# Altium schematic sheet MBoard.SchDoc
size A4
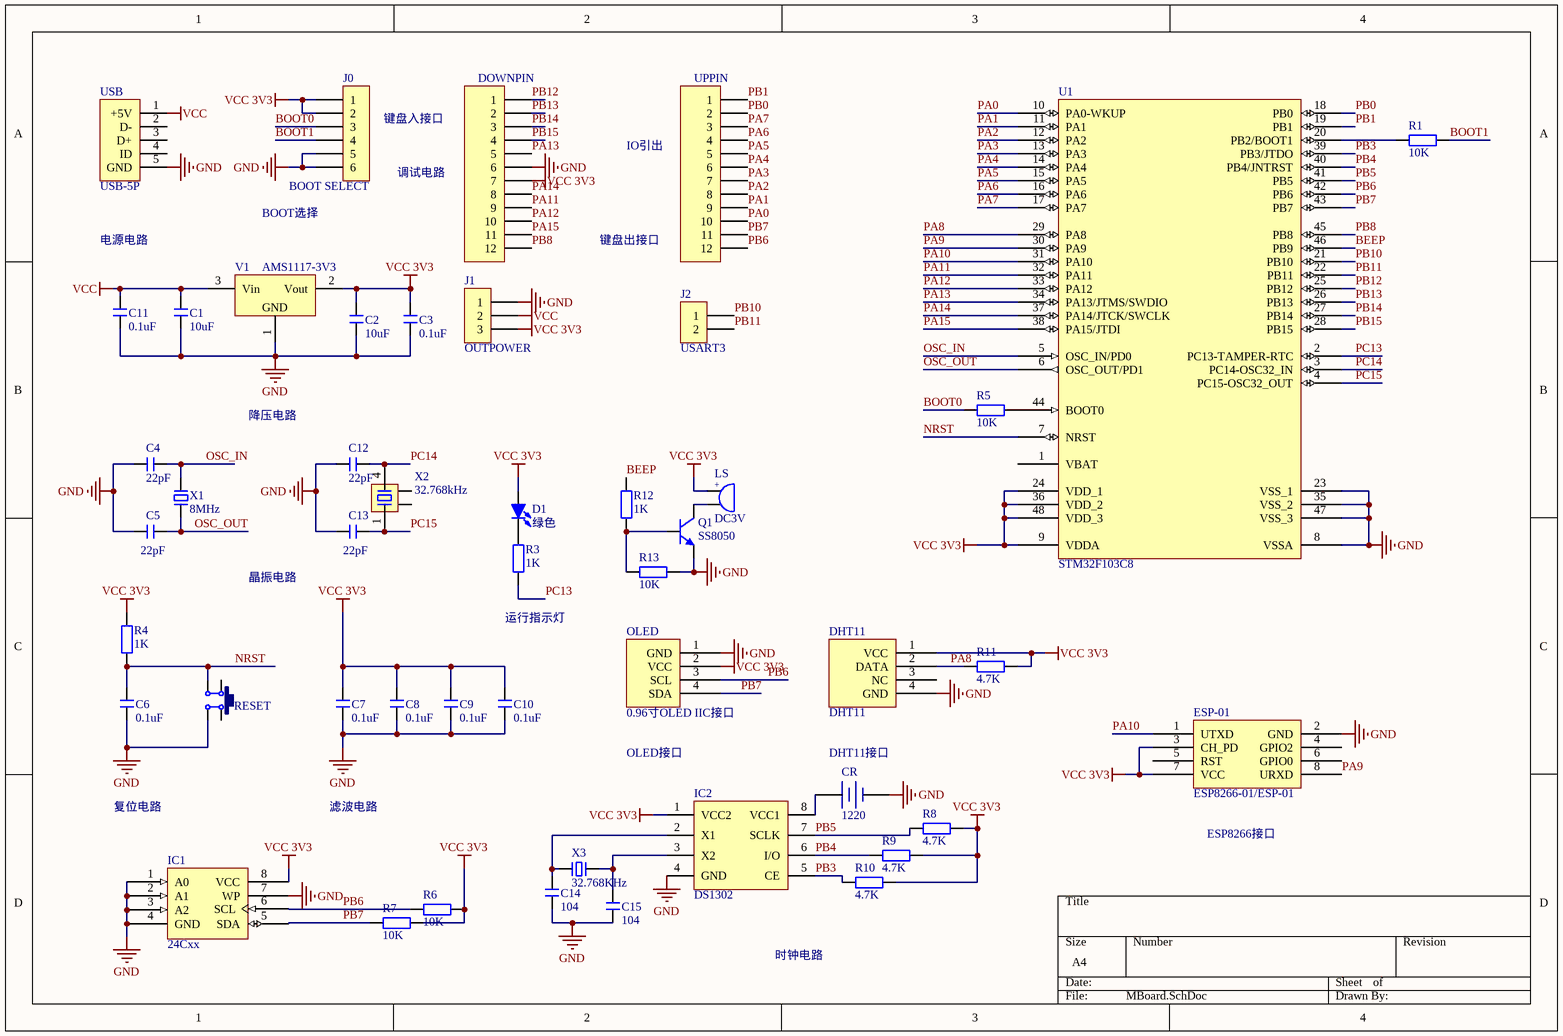
[diagram p0: MBoard.SchDoc]

## Parts
C1  10uF  [C 0805_L]
C2  10uF  [C 0805_L]
C3  0.1uF  [C 0805_L]
C4  22pF  [C 0805_L]
C5  22pF  [C 0805_L]
C6  0.1uF  [C 0805_L]
C7  0.1uF  [C 0805_L]
C8  0.1uF  [C 0805_L]
C9  0.1uF  [C 0805_L]
C10  0.1uF  [C 0805_L]
C11  0.1uF  [C 0805_L]
C12  22pF  [C 0805_L]
C13  22pF  [C 0805_L]
C14  104  [C 0805_L]
C15  104  [C 0805_L]
CR  1220  [CR1220_A]
D1  绿色  [LED 0805R]
DHT11  DHT11  [HDR2.54-LI-4P]
DOWNPIN  CON12  [HDR2.54-LI-12P]  (value not drawn)
ESP-01  ESP8266-01/ESP-01  [ESP-01S NOBRODER]
IC1  24Cxx  [SOP8_M]
IC2  DS1302  [SOP8_M]
J0  BOOT SELECT  [HDR2.54-LI-2x3P]
J1  OUTPOWER  [HDR2.54-LI-3P]
J2  USART3  [HDR2.54-WI-2P]
LS  DC3V  [BEEP 6.5x12x6]
OLED  0.96寸OLED IIC接口  [HDR2.54-M-LI-4P]
Q1  SS8050  [SOT23-3N]
R1  10K  [R 0805_L]
R3  1K  [R 0805_L]
R4  1K  [R 0805_L]
R5  10K  [R 0805_L]
R6  10K  [R 0805_L]
R7  10K  [R 0805_L]
R8  4.7K  [R 0805_L]
R9  4.7K  [R 0805_L]
R10  4.7K  [R 0805_L]
R11  4.7K  [R 0805_L]
R12  1K  [R 0805_L]
R13  10K  [R 0805_L]
RESET  6x6x5  [TSW SMD-6*6*4.3]  (value not drawn)
U1  STM32F103C8  [LQFP48 7X7_M]
UPPIN  CON12  [HDR2.54-LI-12P]  (value not drawn)
USB  USB-5P  [USB-MICRO_A]
V1  AMS1117-3V3  [SOT223_L]
X1  8MHz  [OSC HC-49S]
X2  32.768kHz  [OSC MC-306]
X3  32.768KHz  [OSC-2x6-WI-A]

## Nets
GND: C1.1 C2.1 C3.1 C4.1 C5.1 C6.1 C7.1 C8.1 C9.1 C10.1 C11.1 C12.1 C13.1 C14.1 C15.1 CR.2(DC-) DHT11.4(GND) DOWNPIN.6 ESP-01.2(GND) IC1.1(A0) IC1.2(A1) IC1.3(A2) IC1.4(GND) IC1.7(WP) IC2.4(GND) J0.5 J0.6 J1.1 OLED.1(GND) Q1.2(E) R13.2 RESET.3 U1.8(VSSA) U1.23(VSS_1) U1.35(VSS_2) U1.47(VSS_3) USB.5(GND) V1.1(GND)
VCC: C1.2 C11.2 J1.2 USB.1(+5V) V1.3(Vin)
VCC 3V3: C2.2 C3.2 C7.2 C8.2 C9.2 C10.2 D1.1(A) DHT11.1(VCC) DOWNPIN.7 ESP-01.3(CH_PD) ESP-01.7(VCC) IC1.8(VCC) IC2.1(VCC2) J0.1 J0.2 J1.3 LS.1 OLED.2(VCC) R4.2 R6.2 R7.2 R8.2 R9.2 R10.2 R11.2 U1.9(VDDA) U1.24(VDD_1) U1.36(VDD_2) U1.48(VDD_3) V1.2(Vout)
BEEP: R12.2 U1.46(PB9)
BOOT0: J0.3 R5.1
BOOT1: J0.4 R1.2
NRST: C6.2 R4.1 RESET.4 U1.7(NRST)
OSC_IN: C4.2 U1.5(OSC_IN/PD0) X1.2
OSC_OUT: C5.2 U1.6(OSC_OUT/PD1) X1.1
PA0: U1.10(PA0-WKUP) UPPIN.10
PA1: U1.11(PA1) UPPIN.9
PA2: U1.12(PA2) UPPIN.8
PA3: U1.13(PA3) UPPIN.7
PA4: U1.14(PA4) UPPIN.6
PA5: U1.15(PA5) UPPIN.5
PA6: U1.16(PA6) UPPIN.4
PA7: U1.17(PA7) UPPIN.3
PA8: DHT11.2(DATA) R11.1 U1.29(PA8)
PA9: ESP-01.8(URXD) U1.30(PA9)
PA10: ESP-01.1(UTXD) U1.31(PA10)
PA11: DOWNPIN.9 U1.32(PA11)
PA12: DOWNPIN.10 U1.33(PA12)
PA13: DOWNPIN.5 U1.34(PA13/JTMS/SWDIO)
PA14: DOWNPIN.8 U1.37(PA14/JTCK/SWCLK)
PA15: DOWNPIN.11 U1.38(PA15/JTDI)
PB0: U1.18(PB0) UPPIN.2
PB1: U1.19(PB1) UPPIN.1
PB3: IC2.5(CE) R10.1 U1.39(PB3/JTDO)
PB4: IC2.6(I/O) R9.1 U1.40(PB4/JNTRST)
PB5: IC2.7(SCLK) R8.1 U1.41(PB5)
PB6: IC1.6(SCL) OLED.3(SCL) R6.1 U1.42(PB6) UPPIN.12
PB7: IC1.5(SDA) OLED.4(SDA) R7.1 U1.43(PB7) UPPIN.11
PB8: DOWNPIN.12 U1.45(PB8)
PB10: J2.1 U1.21(PB10)
PB11: J2.2 U1.22(PB11)
PB12: DOWNPIN.1 U1.25(PB12)
PB13: DOWNPIN.2 U1.26(PB13)
PB14: DOWNPIN.3 U1.27(PB14)
PB15: DOWNPIN.4 U1.28(PB15)
PC13: R3.1 U1.2(PC13-TAMPER-RTC)
PC14: C12.2 U1.3(PC14-OSC32_IN) X2.4
PC15: C13.2 U1.4(PC15-OSC32_OUT) X2.1
NetC14_2: C14.2 IC2.2(X1) X3.1
NetC15_2: C15.2 IC2.3(X2) X3.2
NetCR_1: CR.1(DC+) IC2.8(VCC1)
NetD1_2: D1.2(K) R3.2
NetLS_2: LS.2 Q1.3(C)
NetQ1_1: Q1.1(B) R12.1 R13.1
NetR1_1: R1.1 U1.20(PB2/BOOT1)
NetR5_2: R5.2 U1.44(BOOT0)

Not connected (* = marked no-connect by the designer): DHT11 3(NC); ESP-01 4(GPIO2) 5(RST) 6(GPIO0); RESET 1 2; U1 1(VBAT); USB 2(D-) 3(D+) 4(ID); X2 2 3

## Notes on the sheet
- (near J0) 键盘入接口
- 调试电路
- IO引出
- 电源电路
- BOOT选择
- 键盘出接口
- 降压电路
- 晶振电路
- (near R3) 运行指示灯
- OLED接口
- (near CR) DHT11接口
- 复位电路
- 滤波电路
- ESP8266接口
- 时钟电路
- (in symbol BEEP) +

## Library data of the parts
C1-C15 = C: 无极性贴片电容; 版权归属: 源创客; BOM名称: 无极性贴片电容; 学习资源: www.ooocke.com
CR = CR-3V: 微型电池; 版权归属: 源创客; BOM名称: 微型电池; 学习资源: www.ooocke.com
D1 = LED-SMD: 贴片LED; 版权归属: 源创客; BOM名称: 贴片LED; 学习资源: www.ooocke.com
DOWNPIN UPPIN = CON12: Connector
ESP-01 = ESP8266-01: ESP8266-01 接口
IC1 = 24Cxx: 外置EEPROM; 版权归属: 源创客; BOM名称: 外置EEPROM; 学习资源: www.ooocke.com
IC2 = DS1302: 实时时钟芯片; 版权归属: 源创客; BOM名称: 实时时钟芯片; 学习资源: www.ooocke.com
J0 = CON6: Connector
J1 = CON3: Connector
J2 = CON2: Connector
LS = BEEP: 蜂鸣器; 版权归属: 源创客; BOM名称: 蜂鸣器; 学习资源: www.ooocke.com
OLED = OLED0.96_IIC: 0.96寸OLED  IIC接口
Q1 = 8050-SMD: 高频放大-NPN型; 版权归属: 源创客; 属性: 40V 1.5A 1W 100MHZ; BOM名称: 高频放大-NPN型; 学习资源: www.ooocke.com
R1 R3-R13 = R: 贴片电阻; 版权归属: 源创客; BOM名称: 贴片电阻; 学习资源: www.ooocke.com
RESET = TSW SMD-6x6: 贴片6x6轻触开关; 版权归属: 源创客; BOM名称: 贴片6x6轻触开关; 学习资源: www.ooocke.com
U1 = STM32F103C8: Flaah:64/RAM:20/IO:36; BOM名称: 32位STM单片机; 版权归属: 源创客; 学习资源: www.ooocke.com
USB = USB-5P: 微型USB母座; 版权归属: 源创客; BOM名称: 微型USB母座; 学习资源: www.ooocke.com
V1 = AMS1117: 三端稳压芯片; BOM名称: 稳压芯片; 版权归属: 源创客; 学习资源: www.ooocke.com
X1 X3 = XTAL-2P: 2脚无源脚晶振; 版权归属: 源创客; BOM名称: 2脚无源脚晶振; 学习资源: www.ooocke.com
X2 = XTAL-MC-4P: MC系列4脚晶振; BOM名称: 2脚无源脚晶振; 版权归属: 源创客; 学习资源: www.ooocke.com